# Altium schematic sheet Buck Boost 19V.SchDoc
size Tabloid; Date: Date; Author: Author 1; DocumentNumber: 7; Revision: 1; SheetNumber: 7; SheetTotal: 7; Size: 11x17; Sheet_Name: Boost 19V
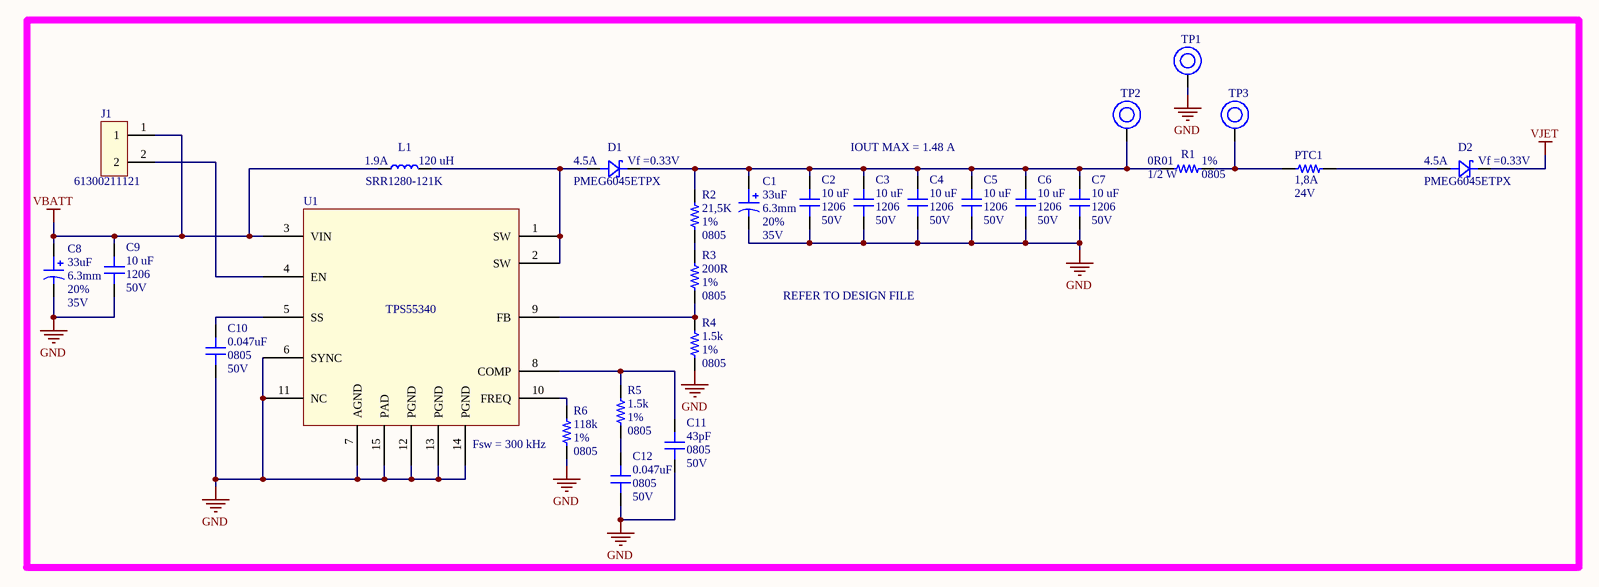
[diagram p0: Buck Boost 19V.SchDoc]

## Parts
C1  value 33uF  Package: 6.3mm  Tolerance: 20%  Voltage: 35V  [CAP ALU - 6.3mm DIA]  (hidden comment: CAP ALU - 6.3mm)
C2  value 10 uF  Package: 1206  Voltage: 50V  [CAP_1206]  (hidden comment: CAP - 1206)
C3  value 10 uF  Package: 1206  Voltage: 50V  [CAP_1206]  (hidden comment: CAP - 1206)
C4  value 10 uF  Package: 1206  Voltage: 50V  [CAP_1206]  (hidden comment: CAP - 1206)
C5  value 10 uF  Package: 1206  Voltage: 50V  [CAP_1206]  (hidden comment: CAP - 1206)
C6  value 10 uF  Package: 1206  Voltage: 50V  [CAP_1206]  (hidden comment: CAP - 1206)
C7  value 10 uF  Package: 1206  Voltage: 50V  [CAP_1206]  (hidden comment: CAP - 1206)
C8  value 33uF  Package: 6.3mm  Tolerance: 20%  Voltage: 35V  [CAP ALU - 6.3mm DIA]  (hidden comment: CAP ALU - 6.3mm)
C9  value 10 uF  Package: 1206  Voltage: 50V  [CAP_1206]  (hidden comment: CAP - 1206)
C10  value 0.047uF  Package: 0805  Voltage: 50V  [CAP_0805]  (hidden comment: CAP - 0805)
C11  value 43pF  Package: 0805  Voltage: 50V  [CAP_0805]  (hidden comment: CAP - 0805)
C12  value 0.047uF  Package: 0805  Voltage: 50V  [CAP_0805]  (hidden comment: CAP - 0805)
D1  Current: 4.5A  Vf: Vf =0.33V  Part number: PMEG6045ETPX  [DO-214AC_SOD128]  (hidden comment: SCHOTTKEY)
D2  Current: 4.5A  Vf: Vf =0.33V  Part number: PMEG6045ETPX  [DO-214AC_SOD128]  (hidden comment: SCHOTTKEY)
J1  Part number: 61300211121  [HDR1X2]  (hidden comment: Header 2 pin SM)
L1  value 120 uH  Current: 1.9A  Part number: SRR1280-121K  [BOURNS 12.5x12.5mm]  (hidden comment: IND)
PTC1  Trip value: 1,8A  Voltage: 24V  [PTC - 1812]  (hidden comment: PTC - 1812)
R1  value 0R01  Watt: 1/2 W  Tolerance: 1%  Package: 0805  [FER_0805]  (hidden comment: RES - 0805)
R2  value 21,5K  Tolerance: 1%  Package: 0805  [FER_0805]  (hidden comment: RES - 0805)
R3  value 200R  Tolerance: 1%  Package: 0805  [FER_0805]  (hidden comment: RES - 0805)
R4  value 1.5k  Tolerance: 1%  Package: 0805  [FER_0805]  (hidden comment: RES - 0805)
R5  value 1.5k  Tolerance: 1%  Package: 0805  [FER_0805]  (hidden comment: RES - 0805)
R6  value 118k  Tolerance: 1%  Package: 0805  [FER_0805]  (hidden comment: RES - 0805)
TP1  TestPoint 3x3mm  [TestPoint 3X3mm]  (value not drawn)
TP2  TestPoint 3x3mm  [TestPoint 3X3mm]  (value not drawn)
TP3  TestPoint 3x3mm  [TestPoint 3X3mm]  (value not drawn)
U1  TPS55340  [14-TSSOP]  (value not drawn)

## Nets
GND: C1.2 C2.2 C3.2 C4.2 C5.2 C6.2 C7.2 C8.2 C9.2 C10.2 C11.2 C12.2 R4.2 R6.2 TP1.1 U1.6(SYNC) U1.7(AGND) U1.11(NC) U1.12(PGND) U1.13(PGND) U1.14(PGND) U1.15(PAD)
VBATT: C8.1 C9.1 J1.1 L1.1 U1.3(VIN)
VJET: D2.2
NetC1_1: C1.1 C2.1 C3.1 C4.1 C5.1 C6.1 C7.1 D1.2 R1.1 R2.1 TP2.1
NetC10_1: C10.1 U1.5(SS)
NetC11_1: C11.1 R5.1 U1.8(COMP)
NetC12_1: C12.1 R5.2
NetD1_1: D1.1 L1.2 U1.1(SW) U1.2(SW)
NetD2_1: D2.1 PTC1.2
NetJ1_2: J1.2 U1.4(EN)
NetPTC1_1: PTC1.1 R1.2 TP3.1
NetR2_2: R2.2 R3.1
NetR3_2: R3.2 R4.1 U1.9(FB)
NetR6_1: R6.1 U1.10(FREQ)

## Notes on the sheet
- IOUT MAX = 1.48 A
- REFER TO DESIGN FILE
- Fsw = 300 kHz
- Sheet Name
- Project Title
- Global Project
- Size
- Group
- Revision
- Date
- Sheet
- of
- Filename
- Designers

## Library data of the parts
C1 C8 = CAP ALU - 6_3mm: Part number: EEE-FK1V330P
C2-C7 C9 = CAP - 1206: Part number: GRT31CR61H106ME01L
C10 C12 = CAP - 0805: Part number: C0805C473K5RACTU
C11 = CAP - 0805: Part number: C0805C430J5GAC7800
PTC1 = PTC - 1812: Part number: 0ZCG0110BF2B; Res: ?; Package: 1812
R1 = RES - 0805: Part number: KRL1220E-M-R010-F-T5
R2 = RES - 0805: Part number: ERJ-6ENF2152V; Watt: 1/8 W
R3 = RES - 0805: Part number: CRCW0805200RFKEA; Watt: 1/8 W
R4 R5 = RES - 0805: Part number: CRCW08051K50FKEA; Watt: ? W
R6 = RES - 0805: Part number: CRCW0805118KFKEA; Watt: ? W
L1 = IND: Package: ?
U1 = TPS55340: Part number: TPS55340